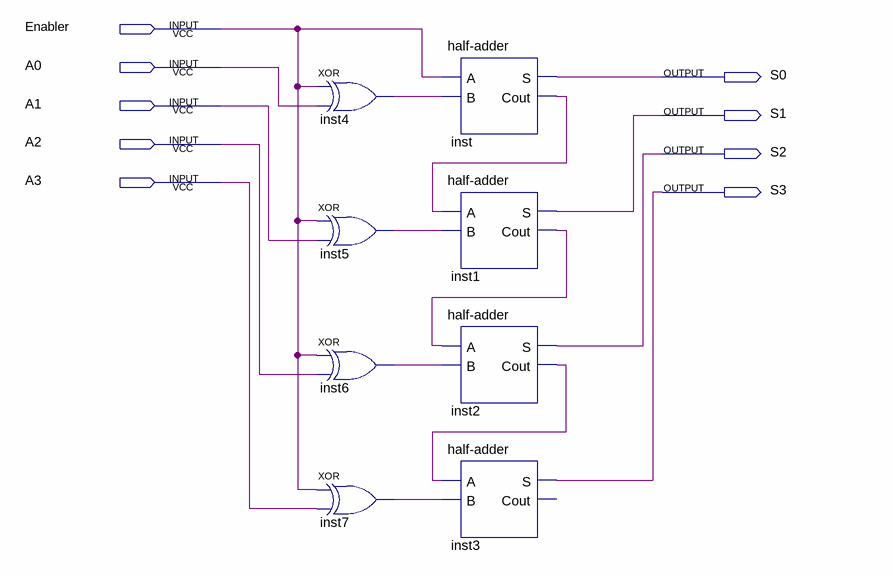
[diagram p0: schematic sheet]
// Quartus schematic bloco_Complemento2_Enable.bdf as structural Verilog: 8 symbols, 9 pins
module bloco_Complemento2_Enable (
  input  Enabler,
  input  A0,
  input  A1,
  input  A2,
  input  A3,
  output S0,
  output S1,
  output S2,
  output S3
);

  wire inst1_cout, inst2_cout, inst4_out, inst5_out, inst6_out, inst7_out, inst_cout;

  xor inst4 (inst4_out, Enabler, A0);
  xor inst5 (inst5_out, Enabler, A1);
  xor inst6 (inst6_out, Enabler, A2);
  xor inst7 (inst7_out, Enabler, A3);
  \half-adder  inst (.A(Enabler), .B(inst4_out), .S(S0), .Cout(inst_cout));
  \half-adder  inst1 (.A(inst_cout), .B(inst5_out), .S(S1), .Cout(inst1_cout));
  \half-adder  inst2 (.A(inst1_cout), .B(inst6_out), .S(S2), .Cout(inst2_cout));
  \half-adder  inst3 (.A(inst2_cout), .B(inst7_out), .S(S3));  // open: Cout
endmodule
